# Altium project Using Design Variants.PrjPcb
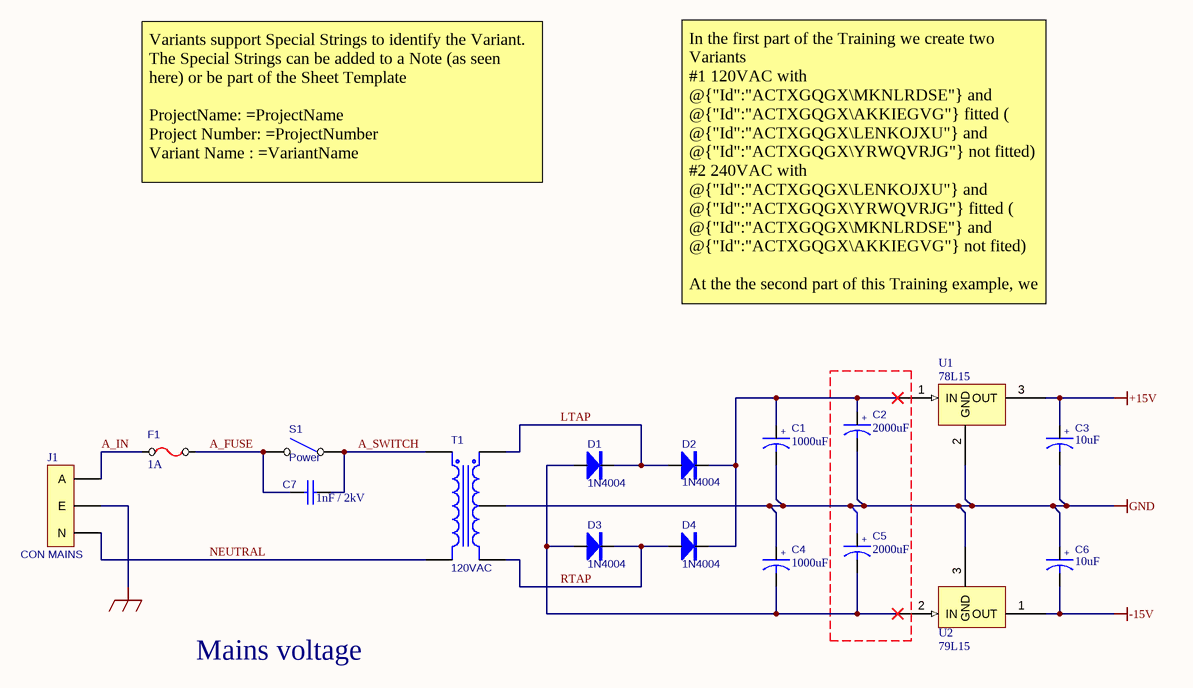
[diagram p0: True Variant.SchDoc]
ProjectNumber: ABC123-Default
1 sheet, 17 parts. Net scope: global (net labels, ports and power ports of the same name join across sheets).
Board file: True Variant.PcbDoc

## Sheet True Variant.SchDoc: Using Design Variants
size 431 x 279 mm; SheetNumber: 1; SheetTotal: 1

### Parts
C1  1000uF  [RB.4/.8]
C2  2000uF  [RB.5/1.0]
C3  10uF  [RB.2/.4]
C4  1000uF  [RB.4/.8]
C5  2000uF  [RB.5/1.0]
C6  10uF  [RB.2/.4]
C7  1nF / 2kV  [RAD0.8]
D1  1N4004  [DIODE0.5]
D2  1N4004  [DIODE0.5]
D3  1N4004  [DIODE0.5]
D4  1N4004  [DIODE0.5]
F1  1A  [FUSE]
J1  CON MAINS  [IEC-MAINS]
S1  Power  [SW-MAINS]
T1  120VAC  [TRANSFORMER]
U1  78L15  [TO-92A]
U2  79L15  [TO-92A]

### Nets
+15V: C3.1 U1.3(OUT)
-15V: C6.2 U2.1(OUT)
CHASSIS: J1.2(E)
GND: C1.2 C2.2 C3.2 C4.1 C5.1 C6.1 T1.4(SecCT) U1.2(GND) U2.3(GND)
A_FUSE: C7.2 F1.2 S1.2(NO)
A_IN: F1.1 J1.1(A)
A_SWITCH: C7.1 S1.1(COMMON) T1.1(Pri+)
LTAP: D1.2(K) D2.1(A) T1.3(Sec+)
NEUTRAL: J1.3(N) T1.2(Pri-)
RTAP: D3.2(K) D4.1(A) T1.5(Sec-)
NetC1_1: C1.1 C2.1 D2.2(K) D4.2(K) U1.1(IN)
NetC4_2: C4.2 C5.2 D1.1(A) D3.1(A) U2.2(IN)

### Notes on the sheet
- Variants support Special Strings to identify the Variant.
  The Special Strings can be added to a Note (as seen here) or be part of the Sheet Template
  ProjectName: =ProjectName
  Project Number: =ProjectNumber
  Variant Name : =VariantName
- In the first part of the Training we create two Variants
  #1 120VAC with @{"Id":"ACTXGQGX\MKNLRDSE"} and @{"Id":"ACTXGQGX\AKKIEGVG"} fitted ( @{"Id":"ACTXGQGX\LENKOJXU"} and @{"Id":"ACTXGQGX\YRWQVRJG"} not fitted)
  #2 240VAC with @{"Id":"ACTXGQGX\LENKOJXU"} and @{"Id":"ACTXGQGX\YRWQVRJG"} fitted ( @{"Id":"ACTXGQGX\MKNLRDSE"} and @{"Id":"ACTXGQGX\AKKIEGVG"} not fited)
  At the the second part of this Training example, we no longer use multiple components to be fitted and unfitted when using variants. @{"Id":"ACTXGQGX\MKNLRDSE"} and @{"Id":"ACTXGQGX\AKKIEGVG"} will change its value from 1000uF to 2000uF whenever the user change the display variant from 120 VAC to 240 VAC at the compile tab.
- Mains voltage
- DWG. NO.
- REV.
- SHT.
- THIS DOCUMENT AND THE DATA DISCLOSED HEREIN OR HEREWITH IS THE PROPERTY OF ALTIUM LIMITED AND MAY BE FREELY DISTRIBUTED IN WHOLE. NO RIGHTS ARE RESERVED OR EXPRESS OR IMPLIED WARANTEE GIVEN.
- REVISION
- DESCRIPTION
- DATE
- APPROVED
- ENG:
- APPROVALS
- PROJECT
- DSN:
- CHK:
- REFERENCE DOCUMENTS
- PROJECT REVISION:
- TITLE
- DOCUMENT REVISION:
- DESIGN ITEM:
- BOM:
- FAB DWG:
- PCB DWG:
- ASSY DWG:
- SCALE:
- SIZE
- B
- CAGE CODE
- FILE NAME
- DWG NO.
- SHEET
- OF
- REV
- (in symbol CAP1000uF) +
- (in symbol CAPACITOR POL) +
- (in symbol CAPACITOR POL2) +

### Library data of the parts
C1 C4 = CAP1000uF: Bi-Polar Capacitor
C2 C5 = CAPACITOR POL2: Bi-Polar Capacitor
C3 C6 = CAPACITOR POL: Bi-Polar Capacitor
C7 = CAP: Capacitor
D1-D4 = 1N4004: Diode
F1 = FUSE
J1 = CON MAINS: Connector
S1 = SW SPST
T1 = 120VAC: Center-Tapped Transformer
U1 = 78L15: Very Low Drop Voltage Regulators With Inhibit
U2 = 79L15: Very Low Drop Voltage Regulators With Inhibit